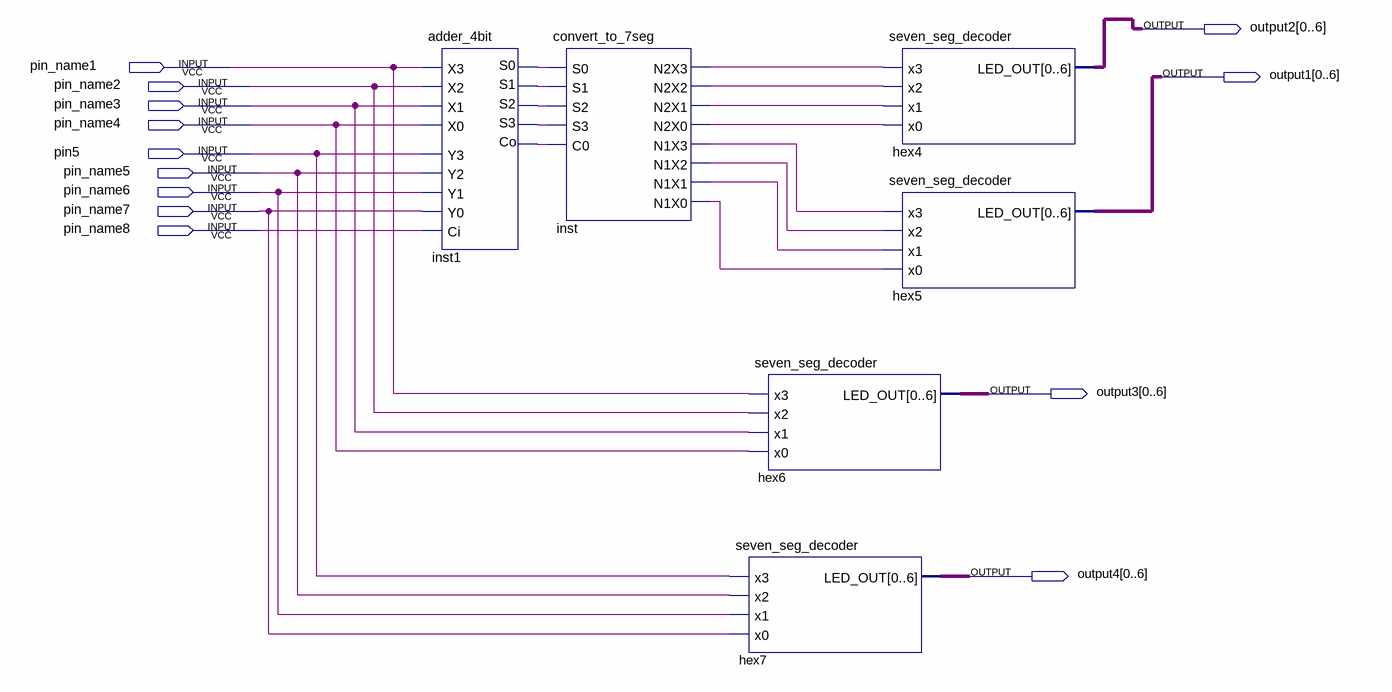
[diagram p0: schematic sheet]
// Quartus schematic Lab06.bdf as structural Verilog: 6 symbols, 13 pins
module Lab06 (
  input  pin_name1,
  input  pin_name2,
  input  pin_name3,
  input  pin_name4,
  input  pin5,
  input  pin_name5,
  input  pin_name6,
  input  pin_name7,
  input  pin_name8,
  output [0:6] output2,
  output [0:6] output1,
  output [0:6] output3,
  output [0:6] output4
);

  wire inst1_co, inst1_s0, inst1_s1, inst1_s2, inst1_s3, inst_n1x0, inst_n1x1, inst_n1x2, inst_n1x3,
       inst_n2x0, inst_n2x1, inst_n2x2, inst_n2x3;

  adder_4bit inst1 (
    .X3(pin_name1), .Y3(pin5), .X2(pin_name2), .Y2(pin_name5), .X1(pin_name3), .Y1(pin_name6),
    .X0(pin_name4), .Y0(pin_name7), .Ci(pin_name8), .S0(inst1_s0), .S1(inst1_s1), .S2(inst1_s2),
    .S3(inst1_s3), .Co(inst1_co));
  convert_to_7seg inst (
    .S0(inst1_s0), .S1(inst1_s1), .S2(inst1_s2), .S3(inst1_s3), .C0(inst1_co), .N2X3(inst_n2x3),
    .N2X2(inst_n2x2), .N2X1(inst_n2x1), .N2X0(inst_n2x0), .N1X3(inst_n1x3), .N1X2(inst_n1x2),
    .N1X1(inst_n1x1), .N1X0(inst_n1x0));
  seven_seg_decoder hex7 (.x3(pin5), .x2(pin_name5), .x1(pin_name6), .x0(pin_name7), .LED_OUT(output4));
  seven_seg_decoder hex6 (.x3(pin_name1), .x2(pin_name2), .x1(pin_name3), .x0(pin_name4), .LED_OUT(output3));
  seven_seg_decoder hex4 (.x3(inst_n2x3), .x2(inst_n2x2), .x1(inst_n2x1), .x0(inst_n2x0), .LED_OUT(output2));
  seven_seg_decoder hex5 (.x3(inst_n1x3), .x2(inst_n1x2), .x1(inst_n1x1), .x0(inst_n1x0), .LED_OUT(output1));
endmodule
